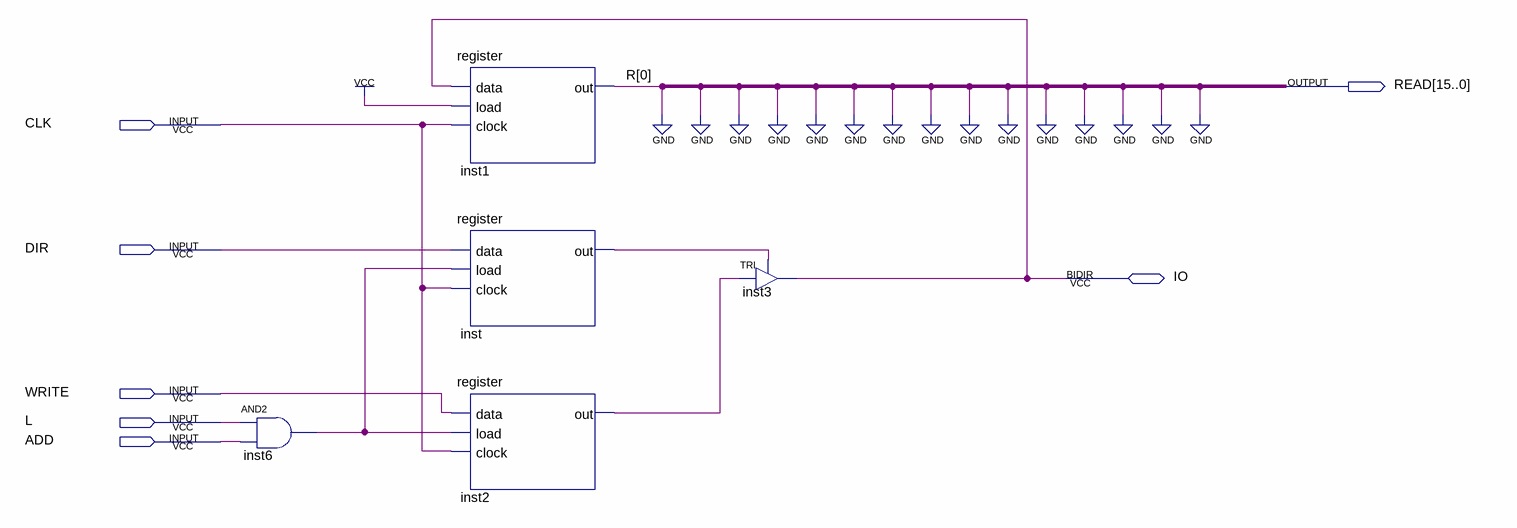
[diagram p0: schematic sheet]
// Quartus schematic GPIO_Single_Cell.bdf as structural Verilog: 5 symbols, 7 pins
module GPIO_Single_Cell (
  input  CLK,
  input  DIR,
  input  WRITE,
  input  L,
  input  ADD,
  inout  IO,
  output [15:0] READ
);

  wire inst2_out, inst6_out, inst_out;

  and inst6 (inst6_out, L, ADD);
  register inst1 (.data(IO), .load(1'b1), .clock(CLK), .out(READ[0]));
  register inst (.data(DIR), .load(inst6_out), .clock(CLK), .out(inst_out));
  register inst2 (.data(WRITE), .load(inst6_out), .clock(CLK), .out(inst2_out));
  TRI inst3 (.IN(inst2_out), .OE(inst_out), .OUT(IO));

  assign READ[15:1] = {15{1'b0}};

  // Other names for the same wires on the sheet: R[0] = READ[0]
endmodule
